# EasyEDA Pro project ProDoc_PCB2_1_2024-07-02.epro

# Board PCB2_1
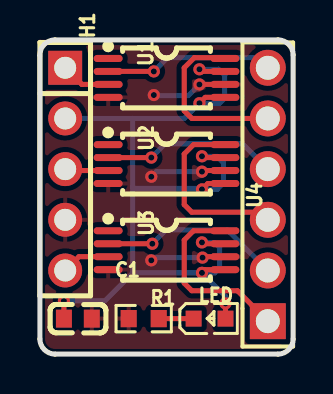
[diagram p0: board, top side]
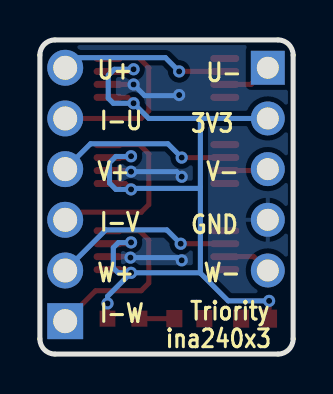
[diagram p1: board, bottom side, seen from below]

Outline 12.7 x 15.75 mm; copper layers: Top Layer, Bottom Layer. Coordinates in mm from the lower left corner of the outline.
Outline path: 0,14.99 0,0.76 arc(0.22,0.22) 0.76,0 11.94,0 arc(12.48,0.22) 12.7,0.76 12.7,14.99 arc(12.48,15.52) 11.94,15.75 0.76,15.75 arc(0.22,15.52) 0,14.99
Stack: Top Layer 0.035mm / Dielectric1 1.51mm FR4 er 4.5 / Bottom Layer 0.035mm

## Design rules (mm)
template: JLCPCB Capability(Two Layers Board)
spacing copperThickness1oz (default): track to track 0.102, other pairs 0.152 to 0.3
spacing copperThickness2oz: track to track 0.203, other pairs 0.152 to 0.3
track width copperThickness1oz (default): min 0.127, default 0.254, max 2.54
track width copperThickness2oz: min 0.203, default 0.254, max 2.54
differential pair differentialPair (default): width min 0.127, default 0.254, max 2.54; gap min 0.152, default 0.152
via viaSize (default): diameter min 0.5, default 0.61, max 10; hole min 0.3, default 0.305, max 6.3

## Placement (name value [footprint] x y rotation side)
C1  100nF  [C0603]  1.91 1.78 180 top
H1  PZ254V-11-05P  [HDR-TH_5P-P2.54-V-M]  1.27 9.27 270 top
LED  KT-0603R  [LED0603-RD]  8.51 1.78 0 top
R1  10kΩ  [R0603]  5.21 1.78 0 top
U1  INA240A2PWR  [TSSOP-8_L4.4-W3.0-P0.65-LS6.4-BL]  6.35 13.84 270 top
U2  INA240A2PWR  [TSSOP-8_L4.4-W3.0-P0.65-LS6.4-BL]  6.35 9.53 270 top
U3  INA240A2PWR  [TSSOP-8_L4.4-W3.0-P0.65-LS6.4-BL]  6.35 5.21 270 top
U4  PZ254V-11-06-0950  [HDR-TH_6P-P2.54-V-M-1]  11.43 8 90 top

## Footprints (pads in the part's own frame, mm; a bottom-side part is the same pattern mirrored in y, then rotated)
C0603
  rect 0.8x0.9 smd: 1(-0.7,0) 2(0.7,0)
HDR-TH_5P-P2.54-V-M
  rect 1.7x1.7 hole 1.1: 1(-5.08,0)
  round 1.7 hole 1.1: 2(-2.54,0) 3(0,0) 4(2.54,0) 5(5.08,0)
HDR-TH_6P-P2.54-V-M-1
  rect 1.8x1.8 hole 1.2: 1(-6.35,0)
  round 1.8 hole 1.2: 2(-3.81,0) 3(-1.27,0) 4(1.27,0) 5(3.81,0) 6(6.35,0)
LED0603-RD
  rect 0.8x0.8 smd: 1(-0.799,0) 2(0.799,0)
R0603
  rect 0.806x0.864 smd: 1(-0.753,0) 2(0.753,0)
TSSOP-8_L4.4-W3.0-P0.65-LS6.4-BL
  oval 0.353x1.454 smd: 1(-0.975,-2.927) 2(-0.325,-2.927) 3(0.325,-2.927) 4(0.975,-2.927) 5(0.975,2.927) 6(0.325,2.927) 7(-0.325,2.927) 8(-0.975,2.927)

## Nets
3V3: C1.2 H1.2 LED.2 U1.5 U1.7 U2.5 U2.7 U3.5 U3.7
GND: C1.1 H1.4 R1.1 U1.4 U1.6 U2.4 U2.6 U3.4 U3.6
I_U: U1.8 U4.5
I_V: U2.8 U4.3
I_W: U3.8 U4.1
OUT_U: H1.1 U1.3
OUT_V: H1.3 U2.3
OUT_W: H1.5 U3.3
U: U1.2 U4.6
V: U2.2 U4.4
W: U3.2 U4.2
$1N1155: LED.1 R1.2

Pads without a net: U1 1; U2 1; U3 1

## Via types
v1: diameter 0.61, hole 0.305, Top Layer to Bottom Layer, 17 vias

## Routing (per net, layer and track width the routed paths; a pad name or vN(x,y) marks a point on that pad's centre or on a via; arc(x,y) is an arc through that point)
3V3: length 47.4
  Top Layer w0.254: U3.7 8.19,5.53 v1(8.13,5.6) ; LED.2 v1(9.31,2.54) ; U1.7 8.11,14.17 v1(8,14.28) ; U1.5 8.3,12.87 v1(8,12.57) ; v1(8.13,9.92) 8.19,9.85 U2.7 ; v1(8.13,8.26) 8.42,8.55 U2.5 ; 9.28,4.23 8.29,4.23 v1(8.13,4.07) ; C1.2 v1(1.2,2.67)
  Bottom Layer w0.254: 4.65,4.06 4.66,4.07 v1(8.13,4.07) ; 4.65,4.06 3.25,2.67 v1(1.2,2.67) ; 4.65,4.06 4.65,8.38 ; v1(8.13,4.07) 9.31,2.89 v1(9.31,2.54) ; v1(8.13,4.07) 8.77,4.07 9.02,4.32 9.02,5.33 8.76,5.59 8.14,5.59 v1(8.13,5.6) ; 4.65,8.38 4.65,11.81 ; 4.65,8.38 4.73,8.31 8.08,8.31 v1(8.13,8.26) 8.89,8.26 9.21,8.57 9.21,9.59 8.89,9.91 8.14,9.91 v1(8.13,9.92) ; 4.65,11.81 7.24,11.81 v1(8,12.57) 9.02,12.57 9.27,12.83 9.27,13.97 8.97,14.28 v1(8,14.28) ; 4.65,11.81 H1.2
GND: length 11.4
  Top Layer w0.254: U1.6 8.01,13.52 v1(8,13.51) ; v1(8.16,4.84) 8.2,4.88 U3.6 ; v1(8.13,9.14) 8.18,9.2 U2.6
  Bottom Layer w0.254: v1(8.13,9.14) 5.84,9.14 v1(5.59,8.89) ; v1(8.16,4.84) 5.72,4.84 v1(5.59,4.7) ; 5.72,12.95 7.44,12.95 v1(8,13.51)
  vias: v1(5.72,12.98)
I_U: length 8.8
  Top Layer w0.254: U4.5 7.62,11.81 7.24,12.19 7.24,14.35 7.75,14.86 9.24,14.86 U1.8
I_V: length 9.3
  Top Layer w0.254: U4.3 11.05,7.11 7.62,7.11 7.24,7.49 7.24,10.03 7.71,10.5 U2.8
I_W: length 9.4
  Top Layer w0.254: U3.8 7.71,6.18 7.24,5.72 7.24,3.56 7.62,3.17 9.91,3.17 U4.1
OUT_U: length 2.5
  Top Layer w0.254: H1.1 2.1,13.52 U1.3
OUT_V: length 2.2
  Top Layer w0.254: U2.3 1.34,9.2 H1.3
OUT_W: length 2.4
  Top Layer w0.254: U3.3 1.96,4.88 H1.5
U: length 8.5
  Top Layer w0.254: U1.2 v1(5.72,14.17)
  Bottom Layer w0.254: U4.6 10.92,14.86 6.41,14.86 v1(5.72,14.17)
V: length 8.8
  Top Layer w0.254: U2.2 v1(5.59,9.85)
  Bottom Layer w0.254: U4.4 10.16,10.54 6.28,10.54 v1(5.59,9.85)
W: length 9.1
  Top Layer w0.254: U3.2 v1(5.64,5.53)
  Bottom Layer w0.254: U4.2 9.4,6.22 6.33,6.22 v1(5.64,5.53)
$1N1155: length 1.7
  Top Layer w0.254: R1.2 LED.1

## Copper pours and planes (outline as drawn; the poured copper is in the pictures)
GND on Top Layer: 0.38,17.91 -2.67,14.86 -2.67,1.14 0.38,-1.91 12.7,-1.91 14.86,0.25 14.86,15.11 12.06,17.91
GND on Bottom Layer: 0.76,18.03 -1.91,15.37 -2.92,15.37 -2.92,0.25 -0.13,-2.54 12.83,-2.54 15.75,0.38 15.75,15.62 13.34,18.03

## Text on the board
Bottom Silkscreen Layer: U- | V- | W- | 3V3 | GND | ina240x3 | I-U | I-V | I-W | U+ | V+ | W+ | Triority
